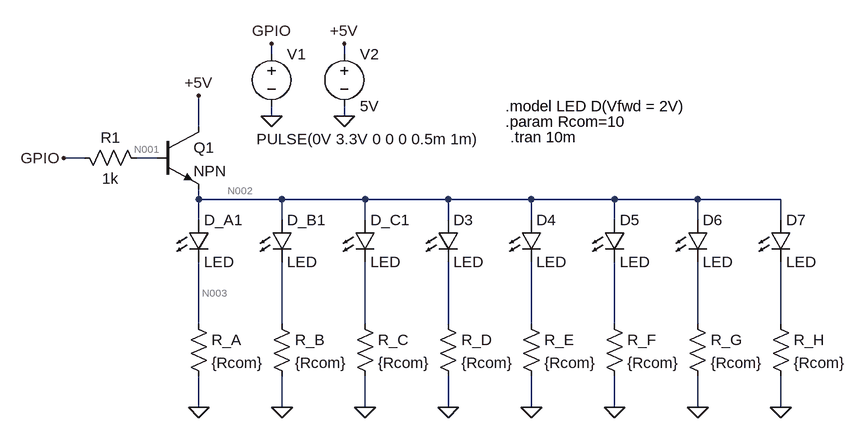
[diagram p0: schematic display_control_npn.asc]
display_control_npn.asc, the LTspice schematic file:
Version 4
SHEET 1 1380 680
WIRE 480 -32 480 -48
WIRE 592 -32 592 -48
WIRE 480 64 480 48
WIRE 592 64 592 48
WIRE 368 80 368 32
WIRE 192 128 160 128
WIRE 304 128 272 128
WIRE 368 192 368 176
WIRE 496 192 368 192
WIRE 624 192 496 192
WIRE 752 192 624 192
WIRE 880 192 752 192
WIRE 1008 192 880 192
WIRE 1136 192 1008 192
WIRE 1264 192 1136 192
WIRE 368 224 368 192
WIRE 496 224 496 192
WIRE 624 224 624 192
WIRE 752 224 752 192
WIRE 880 224 880 192
WIRE 1008 224 1008 192
WIRE 1136 224 1136 192
WIRE 1264 224 1264 192
WIRE 368 384 368 288
WIRE 496 384 496 288
WIRE 624 384 624 288
WIRE 752 384 752 288
WIRE 880 384 880 288
WIRE 1008 384 1008 288
WIRE 1136 384 1136 288
WIRE 1264 384 1264 288
WIRE 368 512 368 464
WIRE 496 512 496 464
WIRE 624 512 624 464
WIRE 752 512 752 464
WIRE 880 512 880 464
WIRE 1008 512 1008 464
WIRE 1136 512 1136 464
WIRE 1264 512 1264 464
FLAG 368 512 0
FLAG 368 32 +5V
FLAG 160 128 GPIO
FLAG 480 64 0
FLAG 592 64 0
FLAG 480 -48 GPIO
FLAG 592 -48 +5V
FLAG 752 512 0
FLAG 880 512 0
FLAG 1008 512 0
FLAG 1136 512 0
FLAG 1264 512 0
FLAG 496 512 0
FLAG 624 512 0
SYMBOL res 352 368 R0
SYMATTR InstName R_A
SYMATTR Value {Rcom}
SYMBOL voltage 480 -48 R0
WINDOW 3 -23 147 Left 2
WINDOW 123 0 0 Left 0
WINDOW 39 0 0 Left 0
SYMATTR Value PULSE(0V 3.3V 0 0 0 0.5m 1m)
SYMATTR InstName V1
SYMBOL voltage 592 -48 R0
WINDOW 123 0 0 Left 0
WINDOW 39 0 0 Left 0
SYMATTR InstName V2
SYMATTR Value 5V
SYMBOL LED 352 224 R0
SYMATTR InstName D_A1
SYMATTR Value LED
SYMBOL LED 480 224 R0
SYMATTR InstName D_B1
SYMATTR Value LED
SYMBOL LED 608 224 R0
SYMATTR InstName D_C1
SYMATTR Value LED
SYMBOL LED 736 224 R0
SYMATTR InstName D3
SYMATTR Value LED
SYMBOL LED 864 224 R0
SYMATTR InstName D4
SYMATTR Value LED
SYMBOL LED 992 224 R0
SYMATTR InstName D5
SYMATTR Value LED
SYMBOL LED 1120 224 R0
SYMATTR InstName D6
SYMATTR Value LED
SYMBOL LED 1248 224 R0
SYMATTR InstName D7
SYMATTR Value LED
SYMBOL res 480 368 R0
SYMATTR InstName R_B
SYMATTR Value {Rcom}
SYMBOL res 608 368 R0
SYMATTR InstName R_C
SYMATTR Value {Rcom}
SYMBOL res 736 368 R0
SYMATTR InstName R_D
SYMATTR Value {Rcom}
SYMBOL res 864 368 R0
SYMATTR InstName R_E
SYMATTR Value {Rcom}
SYMBOL res 992 368 R0
SYMATTR InstName R_F
SYMATTR Value {Rcom}
SYMBOL res 1120 368 R0
SYMATTR InstName R_G
SYMATTR Value {Rcom}
SYMBOL res 1248 368 R0
SYMATTR InstName R_H
SYMATTR Value {Rcom}
SYMBOL npn 304 80 R0
SYMATTR InstName Q1
SYMBOL res 176 112 M90
WINDOW 0 0 56 VBottom 2
WINDOW 3 32 56 VTop 2
SYMATTR InstName R1
SYMATTR Value 1k
TEXT 848 96 Left 2 !.tran 10m
TEXT 840 48 Left 2 !.model LED D(Vfwd = 2V)
TEXT 840 72 Left 2 !.param Rcom=10

The netlist it stands for:
* display_control_npn.asc
R_A N003 0 {Rcom}
V1 GPIO 0 PULSE(0V 3.3V 0 0 0 0.5m 1m)
V2 +5V 0 5V
D_A1 N002 N003 LED
D_B1 N002 N004 LED
D_C1 N002 N005 LED
D3 N002 N006 LED
D4 N002 N007 LED
D5 N002 N008 LED
D6 N002 N009 LED
D7 N002 N010 LED
R_B N004 0 {Rcom}
R_C N005 0 {Rcom}
R_D N006 0 {Rcom}
R_E N007 0 {Rcom}
R_F N008 0 {Rcom}
R_G N009 0 {Rcom}
R_H N010 0 {Rcom}
Q1 +5V N001 N002 0 NPN
R1 GPIO N001 1k
.model D D
.lib standard.dio
.model NPN NPN
.model PNP PNP
.lib standard.bjt
.tran 10m
.model LED D(Vfwd = 2V)
.param Rcom=10
.backanno
.end

* Results of the author's LTspice run, read from the files saved beside the schematic
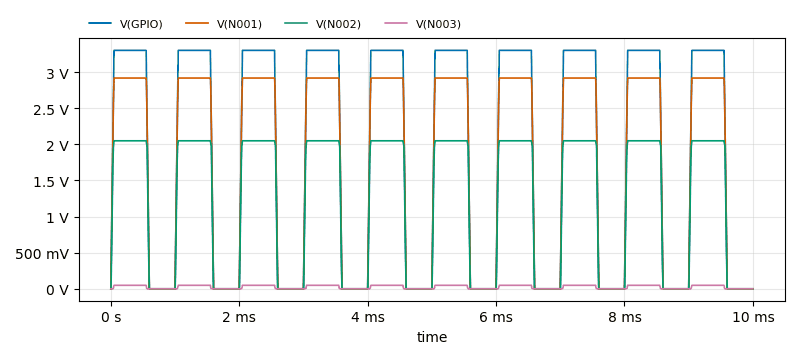
[diagram p1: Transient Analysis of display_control_npn.asc, plotted from the saved traces]
* Transient Analysis, 1 run:
*   V(GPIO): min 0 V, max 3.3 V, average 1.815 V, rms 2.411 V, last 0 V
*   V(N001): min 0 V, max 2.917 V, average 1.619 V, rms 2.144 V, last 0 V
*   V(N002): min 11.1 µV, max 2.048 V, average 1.147 V, rms 1.517 V, last 11.1 µV
*   V(N003): min 0 V, max 48.37 mV, average 24.75 mV, rms 34.48 mV, last 0 V